# Altium schematic sheet supply.SchDoc
size A4
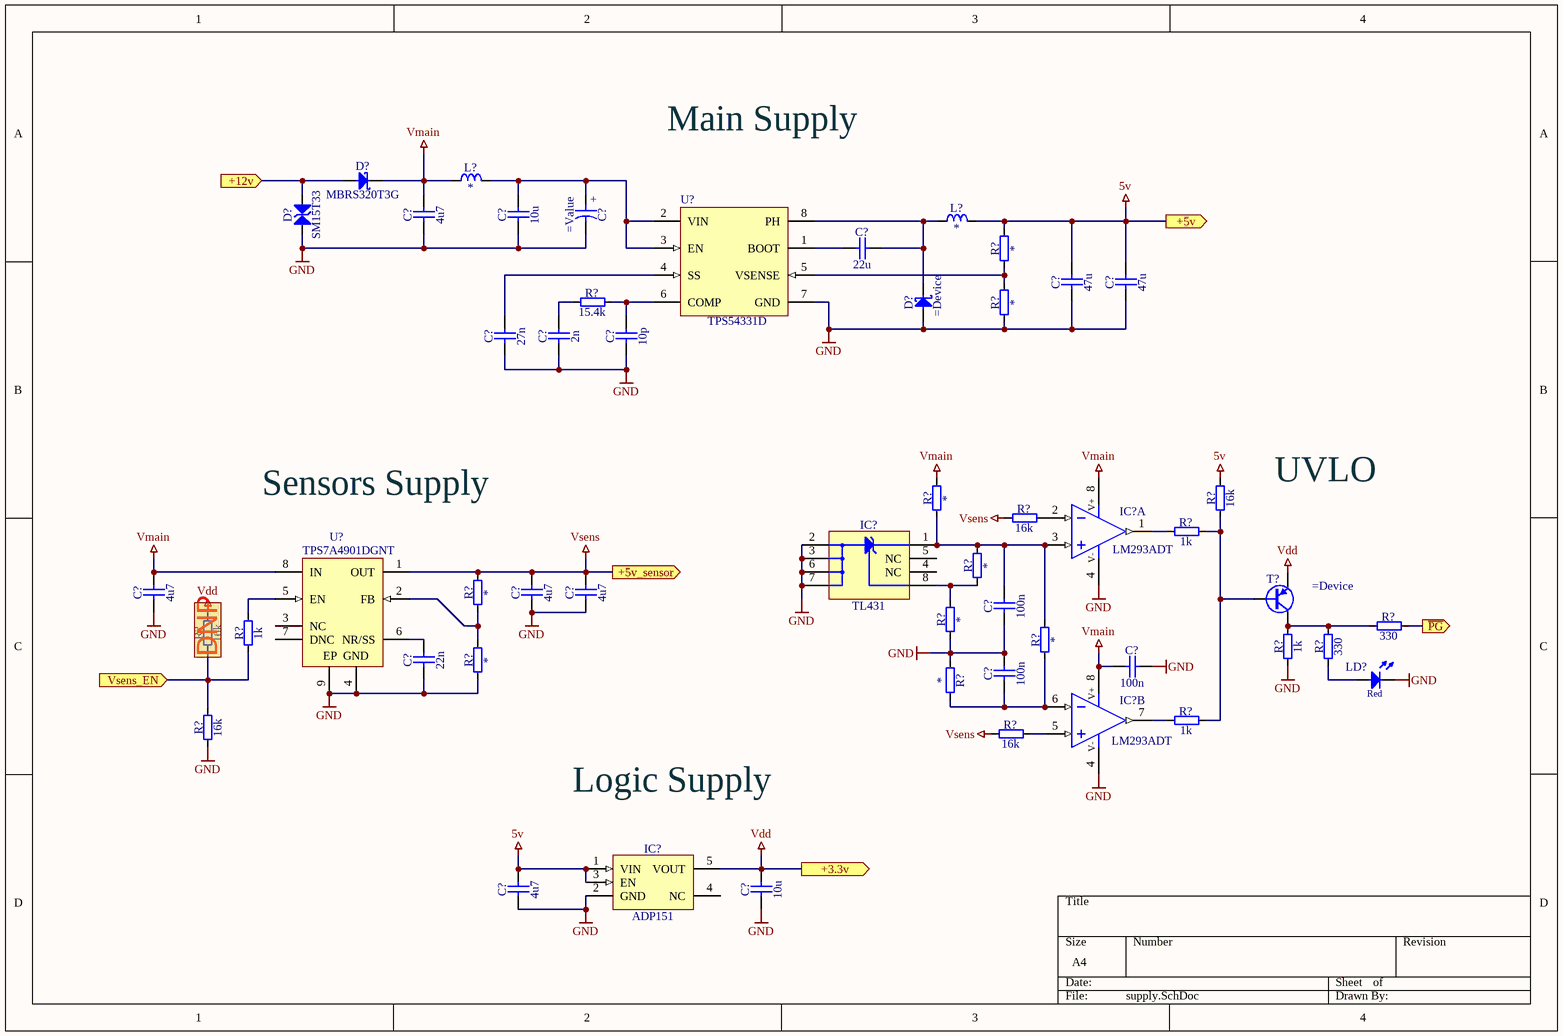
[diagram p0: supply.SchDoc]

## Parts
(Parts that share a designator on the sheet are numbered #1, #2 ... from top to bottom, then left to right.)
C?#1  (no value)
C?#2  4u7
C?#3  10u
C?#4  22u
C?#5  47u
C?#6  47u
C?#7  27n
C?#8  2n
C?#9  10p
C?#10  4u7
C?#11  4u7
C?#12  4u7
C?#13  100n
C?#14  100n
C?#15  22n
C?#16  100n
C?#17  4u7
C?#18  10u
D?#1  MBRS320T3G
D?#2  SM15T33
D?#3  (no value)
IC?#1  LM293ADT  (part A of 2)
IC?#2  TL431
IC?#3  LM293ADT  (part B of 2)
IC?#4  ADP151
L?#1  *
L?#2  *
LD?  (no value)
R?#1  *
R?#2  15.4k
R?#3  *
R?#4  *
R?#5  16k
R?#6  16k
R?#7  1k
R?#8  *
R?#9  *
R?#10  330
R?#11  *
R?#12  16k
R?#13  1k
R?#14  *
R?#15  *
R?#16  1k
R?#17  330
R?#18  *
R?#19  1k
R?#20  16k
R?#21  16k
T?  (no value)
U?#1  TPS54331D  [D8_L]
U?#2  TPS7A4901DGNT  [TI-DGN8-1760X1425TP_L]

## Ports
+3.3v (out), +5v (out), +5v_sensor (out), +12v (in), Vsens_EN (in), ~{PG} (out)

## Nets
5v: C?#5.2 C?#6.2 C?#17.2 IC?#4.1(VIN) IC?#4.3(EN) L?#2.2 R?#1.2 R?#6.2 ; port +5v
GND: C?#1.2 C?#2.1 C?#3.1 C?#5.1 C?#6.1 C?#7.1 C?#8.1 C?#9.1 C?#10.1 C?#11.1 C?#12.1 C?#13.1 C?#14.2 C?#15.1 C?#16.2 C?#17.1 C?#18.1 D?#2.2(A) D?#3.2(A) IC?#1.4(V-) IC?#2.2(A) IC?#2.3(A) IC?#2.6(A) IC?#2.7(A) IC?#3.4(V-) IC?#4.2(GND) LD?.1(C) R?#3.1 R?#11.1 R?#14.1 R?#16.1 R?#18.1 R?#21.1 U?#1.7(GND) U?#2.4(GND) U?#2.9(EP)
Vdd: C?#18.2 IC?#4.5(VOUT) R?#12.2 T?.2(E) ; port +3.3v
Vmain: C?#2.2 C?#10.2 C?#14.1 D?#1.1(C) IC?#1.8(V+) IC?#3.8(V+) L?#1.1 R?#4.2 U?#2.8(IN)
Vsens: C?#11.2 C?#12.2 R?#5.1 R?#9.2 R?#20.1 U?#2.1(OUT) ; port +5v_sensor
+12v: D?#1.2(A) D?#2.1(C) ; port +12v
~{PG}: R?#10.2 ; port ~{PG}
Vsens_EN: R?#12.1 R?#13.1 R?#21.2 ; port Vsens_EN
NetC?#1_1: C?#1.1 C?#3.2 L?#1.2 U?#1.2(VIN) U?#1.3(EN)
NetC?#4_1: C?#4.1 U?#1.1(BOOT)
NetC?#4_2: C?#4.2 D?#3.1(C) L?#2.1 U?#1.8(PH)
NetC?#7_2: C?#7.2 U?#1.4(SS)
NetC?#8_2: C?#8.2 R?#2.1
NetC?#9_2: C?#9.2 R?#2.2 U?#1.6(COMP)
NetC?#13_2: C?#13.2 IC?#1.3(IN+) IC?#2.1(C) R?#4.1 R?#8.2 R?#15.2
NetC?#15_2: C?#15.2 U?#2.6(NR/SS)
NetC?#16_1: C?#16.1 IC?#3.6(IN-) R?#14.2 R?#15.1
NetIC?#1_1: IC?#1.1(OUT) R?#7.1
NetIC?#1_2: IC?#1.2(IN-) R?#5.2
NetIC?#2_8: IC?#2.8(REF) R?#8.1 R?#11.2
NetIC?#3_5: IC?#3.5(IN+) R?#20.2
NetIC?#3_7: IC?#3.7(OUT) R?#19.1
NetLD?_2: LD?.2(A) R?#17.1
NetR?#1_1: R?#1.1 R?#3.2 U?#1.5(VSENSE)
NetR?#6_1: R?#6.1 R?#7.2 R?#19.2 T?.1(B)
NetR?#9_1: R?#9.1 R?#18.2 U?#2.2(FB)
NetR?#10_1: R?#10.1 R?#16.2 R?#17.2 T?.3(C)
NetR?#13_2: R?#13.2 U?#2.5(EN)

Not connected (* = marked no-connect by the designer): IC?#2 4(NC) 5(NC); IC?#4 4(NC); U?#2 3(NC) 7(DNC)

## Notes on the sheet
- Main Supply
- Sensors Supply
- UVLO
- (near R?#12) DNP
- Logic Supply
- (in symbol Capacitor - polarized) +
- (in symbol LED Red 1C 2A) Red

## Library data of the parts
C?#1 = Capacitor - polarized: Polarised capacitor
C?#2-C?#18 = Capacitor - non polarized: Non-polarised capacitor
  C?#2 C?#10-C?#12 C?#17: Value: 4u7
  C?#3 C?#18: Value: 10u
  C?#4: Value: 22u
  C?#5 C?#6: Value: 47u
  C?#7: Value: 27n
  C?#8: Value: 2n
  C?#9: Value: 10p
  C?#13 C?#14 C?#16: Value: 100n
  C?#15: Value: 22n
D?#1 D?#3 = Diode Schottky: Schottky Diode
  D?#1: Device: MBRS320T3G
D?#2 = Diode TVS Bi-Directional: Transient Voltage Suppressor Diode (Bi-Directional); Device: SM15T33
IC?#1 IC?#3 = Operational Amplifier x2 Type1: Dual Operational Amplifier; Device: LM293ADT
IC?#2 = TL1431: Precision Programmable Reference; Device: TL431
IC?#4 = ADP151AUJZ: Ultralow Noise, 200 mA CMOS Linear Regulator; Device: ADP151
L?#1 L?#2 = Inductor: Value: *
LD? = LED Red 1C 2A
R?#1-R?#21 = Resistor
  R?#1 R?#3 R?#4 R?#8 R?#9 R?#11 R?#14 R?#15 R?#18: Value: *
  R?#2: Value: 15.4k
  R?#5 R?#6 R?#12 R?#20 R?#21: Value: 16k
  R?#7 R?#13 R?#16 R?#19: Value: 1k
  R?#10 R?#17: Value: 330
T? = PNP B1 E2 C3: PNP Transistor
U?#1 = TPS54331D: Buck Step Down Regulator with 3.5 to 28 V Input and 0.8 to 25 V Output, -40 to 150 degC, 8-Pin SOIC (D), Green (RoHS & no Sb/Br); Manufacturer: Texas Instruments; Vout(Min)(V): 0.8; Vin(Min)(V): 3.5; Duty Cycle(Max)(%): 90; SubFamily: Step-Down Regulator; Iq(Typ)(mA): 0.11; Vin(Max)(V): 28; Rating: Catalog; Vout(Max)(V): 25; Iout(Max)(A): 3; Regulated Outputs(#): 1; PackageReference: D8; Switch Current Limit(Typ)(A): 3.5; Topology: Buck; Eco-Plan: Green (RoHS & no Sb/Br); PartNumber: TPS54331D; ComponentLink1Description: Datasheet; ComponentLink2Description: Package Specification; DatasheetVersion: SLVS839D; ComponentLink3URL: Samples URL:http://www.ti.com/product/tps54331#samples; ComponentLink1URL: http://www.ti.com/general/docs/lit/getliterature.tsp?genericPartNumber=TPS54331&fileType=pdf; Code_JEDEC: MS-012AA; ComponentLink2URL: http://www.ti.com/litv/pdf/msoi002j; ComponentLink3Description: URL Link1; PackageVersion: revM, Jun-2011; Mounting Technology: Surface Mount; PackageDescription: 8-Pin Plastic Small Outline Integrated Circuit, 4.9 x 3.9 mm, Pitch 1.27 mm Pitch
U?#2 = TPS7A4901DGNT: Single Output High PSRR LDO, 150 mA, Adjustable 1.2 to 33 V Output, 3 to 36 V Input, with Ultra-Low Noise, 8-pin MSOP (DGN), -40 to 125 degC, Green (RoHS & no Sb/Br); Manufacturer: Texas Instruments; Accuracy(%): 1.5; Iq(Typ)(mA): 0.06; Vin(Min)(V): 3; Vout Adj(Min)(V): 1.2; SubFamily: Single Channel LDO; Vout Adj(Max)(V): 33; Vin(Max)(V): 36; Power Good: TRUE; Iout(Max)(A): 0.15; Vdo(Typ)(mV): 260; Eco-Plan: Green (RoHS & no Sb/Br); PartNumber: TPS7A4901DGNT; ComponentLink1Description: Manufacturer URL; ComponentLink2Description: Datasheet; DatasheetVersion: SBVS121B; ComponentLink3URL: http://www.ti.com/litv/pdf/mpds046e; ComponentLink1URL: http://www.ti.com/; Code_JEDEC: MO-187; ComponentLink2URL: http://www.ti.com/general/docs/lit/getliterature.tsp?genericPartNumber=TPS7A4901&fileType=pdf; ComponentLink3Description: Package Specification; PackageVersion: 4073271/F; Mounting Technology: Surface Mount; PackageReference: DGN8-1760X1425TP; PackageDescription: 8-pin Plastic Small Outline, Body 3 x 3 mm, Pitch 0.65 mm